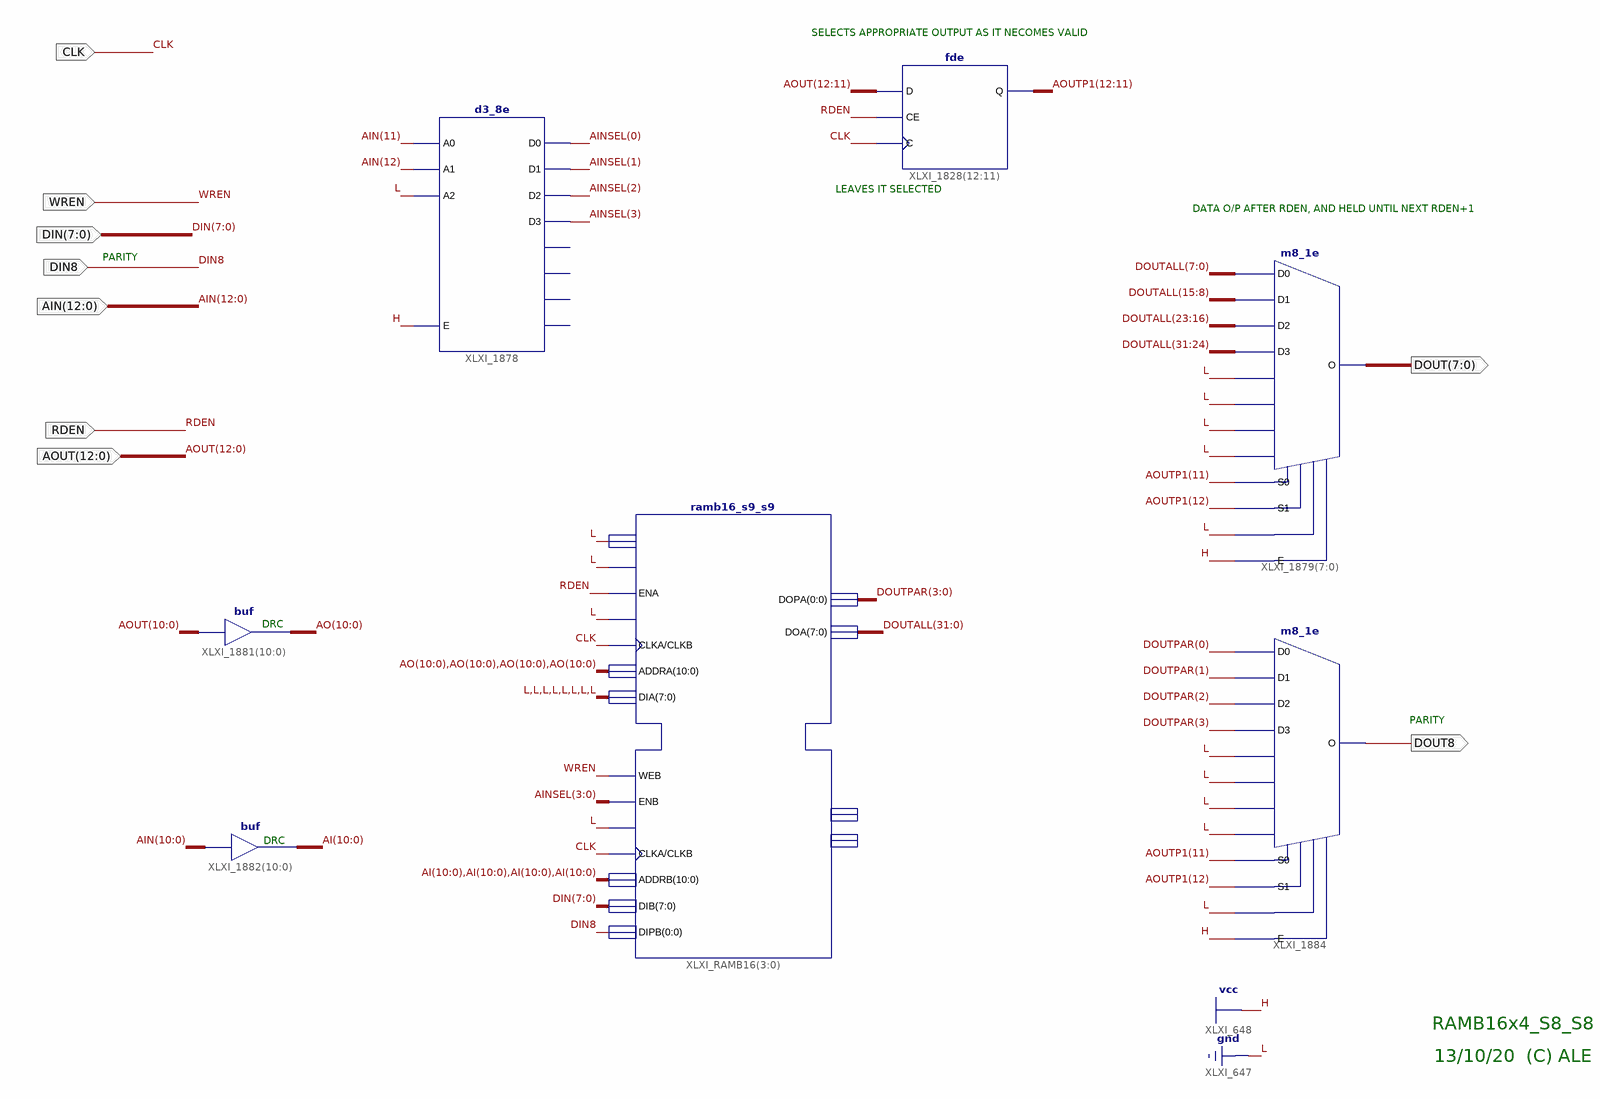
[diagram p0: schematic sheet 1]
// Xilinx ISE schematic RAMB16x4_S8_S8.sch (spartan3e) as structural Verilog: 7 symbols, 9 ports
module RAMB16x4_S8_S8 (
  input  WREN,
  input  RDEN,
  input  [12:0] AOUT,
  input  [12:0] AIN,
  input  [7:0] DIN,
  input  CLK,
  input  DIN8,
  output [7:0] DOUT,
  output DOUT8
);

  wire [3:0] AINSEL, DOUTPAR;
  wire [10:0] AI, AO;
  wire [12:11] AOUTP1;
  wire [31:0] DOUTALL;

  fde XLXI_1828[12:11] (.C(CLK), .CE(RDEN), .D(AOUT[12:11]), .Q(AOUTP1));
  d3_8e XLXI_1878 (
    .A0(AIN[11]), .A1(AIN[12]), .A2(1'b0), .E(1'b1), .D0(AINSEL[0]), .D1(AINSEL[1]), .D2(AINSEL[2]),
    .D3(AINSEL[3]));  // open: D4, D5, D6, D7
  ramb16_s9_s9 XLXI_RAMB16[3:0] (
    .ADDRA({AO, AO, AO, AO}), .ADDRB({AI, AI, AI, AI}), .CLKA(CLK), .CLKB(CLK), .DIA({8{1'b0}}), .DIB(DIN),
    .DIPA(1'b0), .DIPB(DIN8), .ENA(RDEN), .ENB(AINSEL), .SSRA(1'b0), .SSRB(1'b0), .WEA(1'b0), .WEB(WREN),
    .DOA(DOUTALL), .DOPA(DOUTPAR));  // open: DOB, DOPB
  assign AO = AOUT[10:0];  // buf XLXI_1881[10..0], 11 bits wide
  assign AI = AIN[10:0];  // buf XLXI_1882[10..0], 11 bits wide
  m8_1e XLXI_1879[7:0] (
    .D0(DOUTALL[7:0]), .D1(DOUTALL[15:8]), .D2(DOUTALL[23:16]), .D3(DOUTALL[31:24]), .D4(1'b0), .D5(1'b0),
    .D6(1'b0), .D7(1'b0), .E(1'b1), .S0(AOUTP1[11]), .S1(AOUTP1[12]), .S2(1'b0), .O(DOUT));
  m8_1e XLXI_1884 (
    .D0(DOUTPAR[0]), .D1(DOUTPAR[1]), .D2(DOUTPAR[2]), .D3(DOUTPAR[3]), .D4(1'b0), .D5(1'b0), .D6(1'b0),
    .D7(1'b0), .E(1'b1), .S0(AOUTP1[11]), .S1(AOUTP1[12]), .S2(1'b0), .O(DOUT8));

  // Notes on the sheet:
  //   SELECTS APPROPRIATE OUTPUT AS IT NECOMES VALID
  //   LEAVES IT SELECTED
  //   DATA O/P AFTER RDEN, AND HELD UNTIL NEXT RDEN+1
  //   PARITY
  //   DRC
  //   PARITY
  //   DRC
  //   RAMB16x4_S8_S8
  //   13/10/20  (C) ALE
endmodule
